# Altium schematic sheet MISC.SchDoc: MISC
size A; Revision: 1.0; SheetNumber: 5; SheetTotal: 6
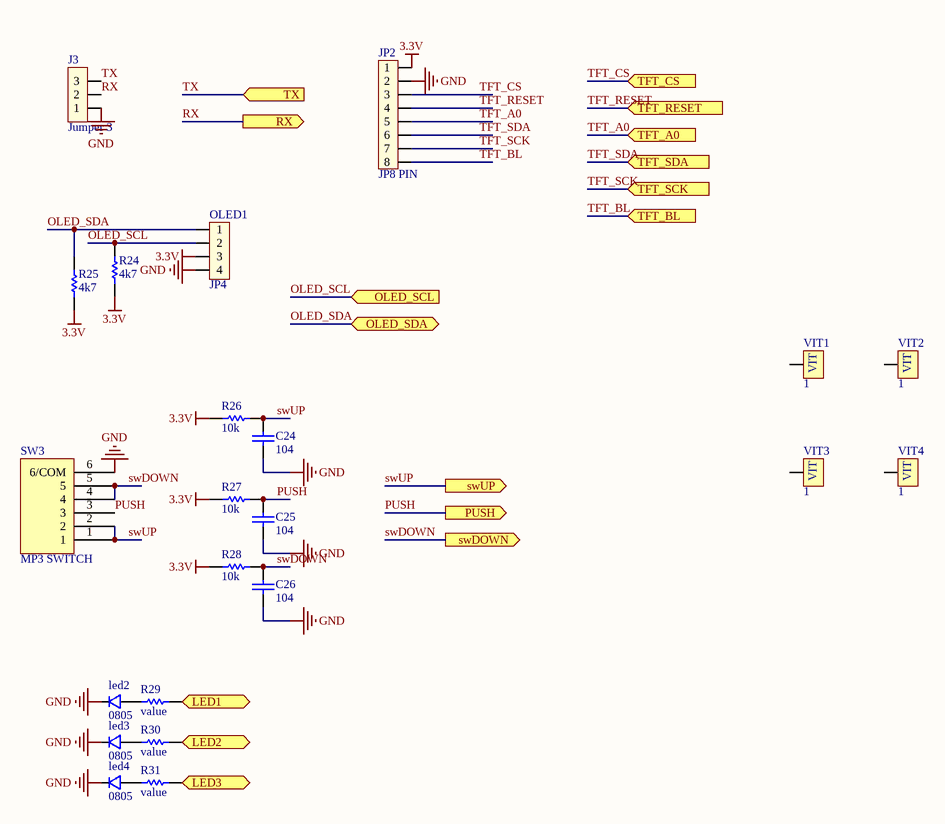
[diagram p0: MISC.SchDoc]

## Parts
C24  104  [Cap 0805]
C25  104  [Cap 0805]
C26  104  [Cap 0805]
J3  Jumper 3  [jp3]
JP2  JP8 PIN  [JP_CAI_8]
led2  0805  [0805]
led3  0805  [0805]
led4  0805  [0805]
OLED1  JP4  [JP_CAI_4]
R24  4k7  [RES 0805]
R25  4k7  [RES 0805]
R26  10k  [RES 0805]
R27  10k  [RES 0805]
R28  10k  [RES 0805]
R29  value  [RES 0805]
R30  value  [RES 0805]
R31  value  [RES 0805]
SW3  MP3 SWITCH  [mp3switch]
VIT1  1  [VIT]
VIT2  1  [VIT]
VIT3  1  [VIT]
VIT4  1  [VIT]

## Ports
LED1 (in), LED2 (in), LED3 (in), OLED_SCL (in), OLED_SDA, PUSH (out), RX (out), swDOWN (out), swUP (out), TFT_A0 (in), TFT_BL (in), TFT_CS (in), TFT_RESET (in), TFT_SCK (in), TFT_SDA (in), TX (in)

## Nets
3.3V: JP2.1 OLED1.3 R24.2 R25.2 R26.2 R27.2 R28.2
GND: C24.1 C25.1 C26.1 J3.1 JP2.2 led2.2 led3.2 led4.2 OLED1.4 SW3.6(6/COM)
LED1: R29.1 ; port LED1
LED2: R30.1 ; port LED2
LED3: R31.1 ; port LED3
OLED_SCL: OLED1.2 R24.1 ; port OLED_SCL
OLED_SDA: OLED1.1 R25.1 ; port OLED_SDA
PUSH: C25.2 R27.1 SW3.3 ; port PUSH
RX: J3.2 ; port RX
swDOWN: C26.2 R28.1 SW3.4 SW3.5 ; port swDOWN
swUP: C24.2 R26.1 SW3.1 SW3.2 ; port swUP
TFT_A0: JP2.5 ; port TFT_A0
TFT_BL: JP2.8 ; port TFT_BL
TFT_CS: JP2.3 ; port TFT_CS
TFT_RESET: JP2.4 ; port TFT_RESET
TFT_SCK: JP2.7 ; port TFT_SCK
TFT_SDA: JP2.6 ; port TFT_SDA
TX: J3.3 ; port TX
Netled2_1: led2.1 R29.2
Netled3_1: led3.1 R30.2
Netled4_1: led4.1 R31.2

Not connected (* = marked no-connect by the designer): VIT1 VIT1(1); VIT2 VIT1(1); VIT3 VIT1(1); VIT4 VIT1(1)

## Notes on the sheet
- Title
- Size:
- Date:
- A
- Number:
- Time:
- Revision:
- Sheet
- of
- File:

## Library data of the parts
C24-C26 = Cap_0805
J3 = JP3: Value: J3
JP2 = JP8: Value: JP7
led2-led4 = led_dan
R24-R31 = Res_0805: resistor smd0805
SW3 = mp3Switch: mp3 navigation switch
VIT1-VIT4 = VIT: Oc Vit